# EAGLE design SprinklerPi (EAGLE 6.3)
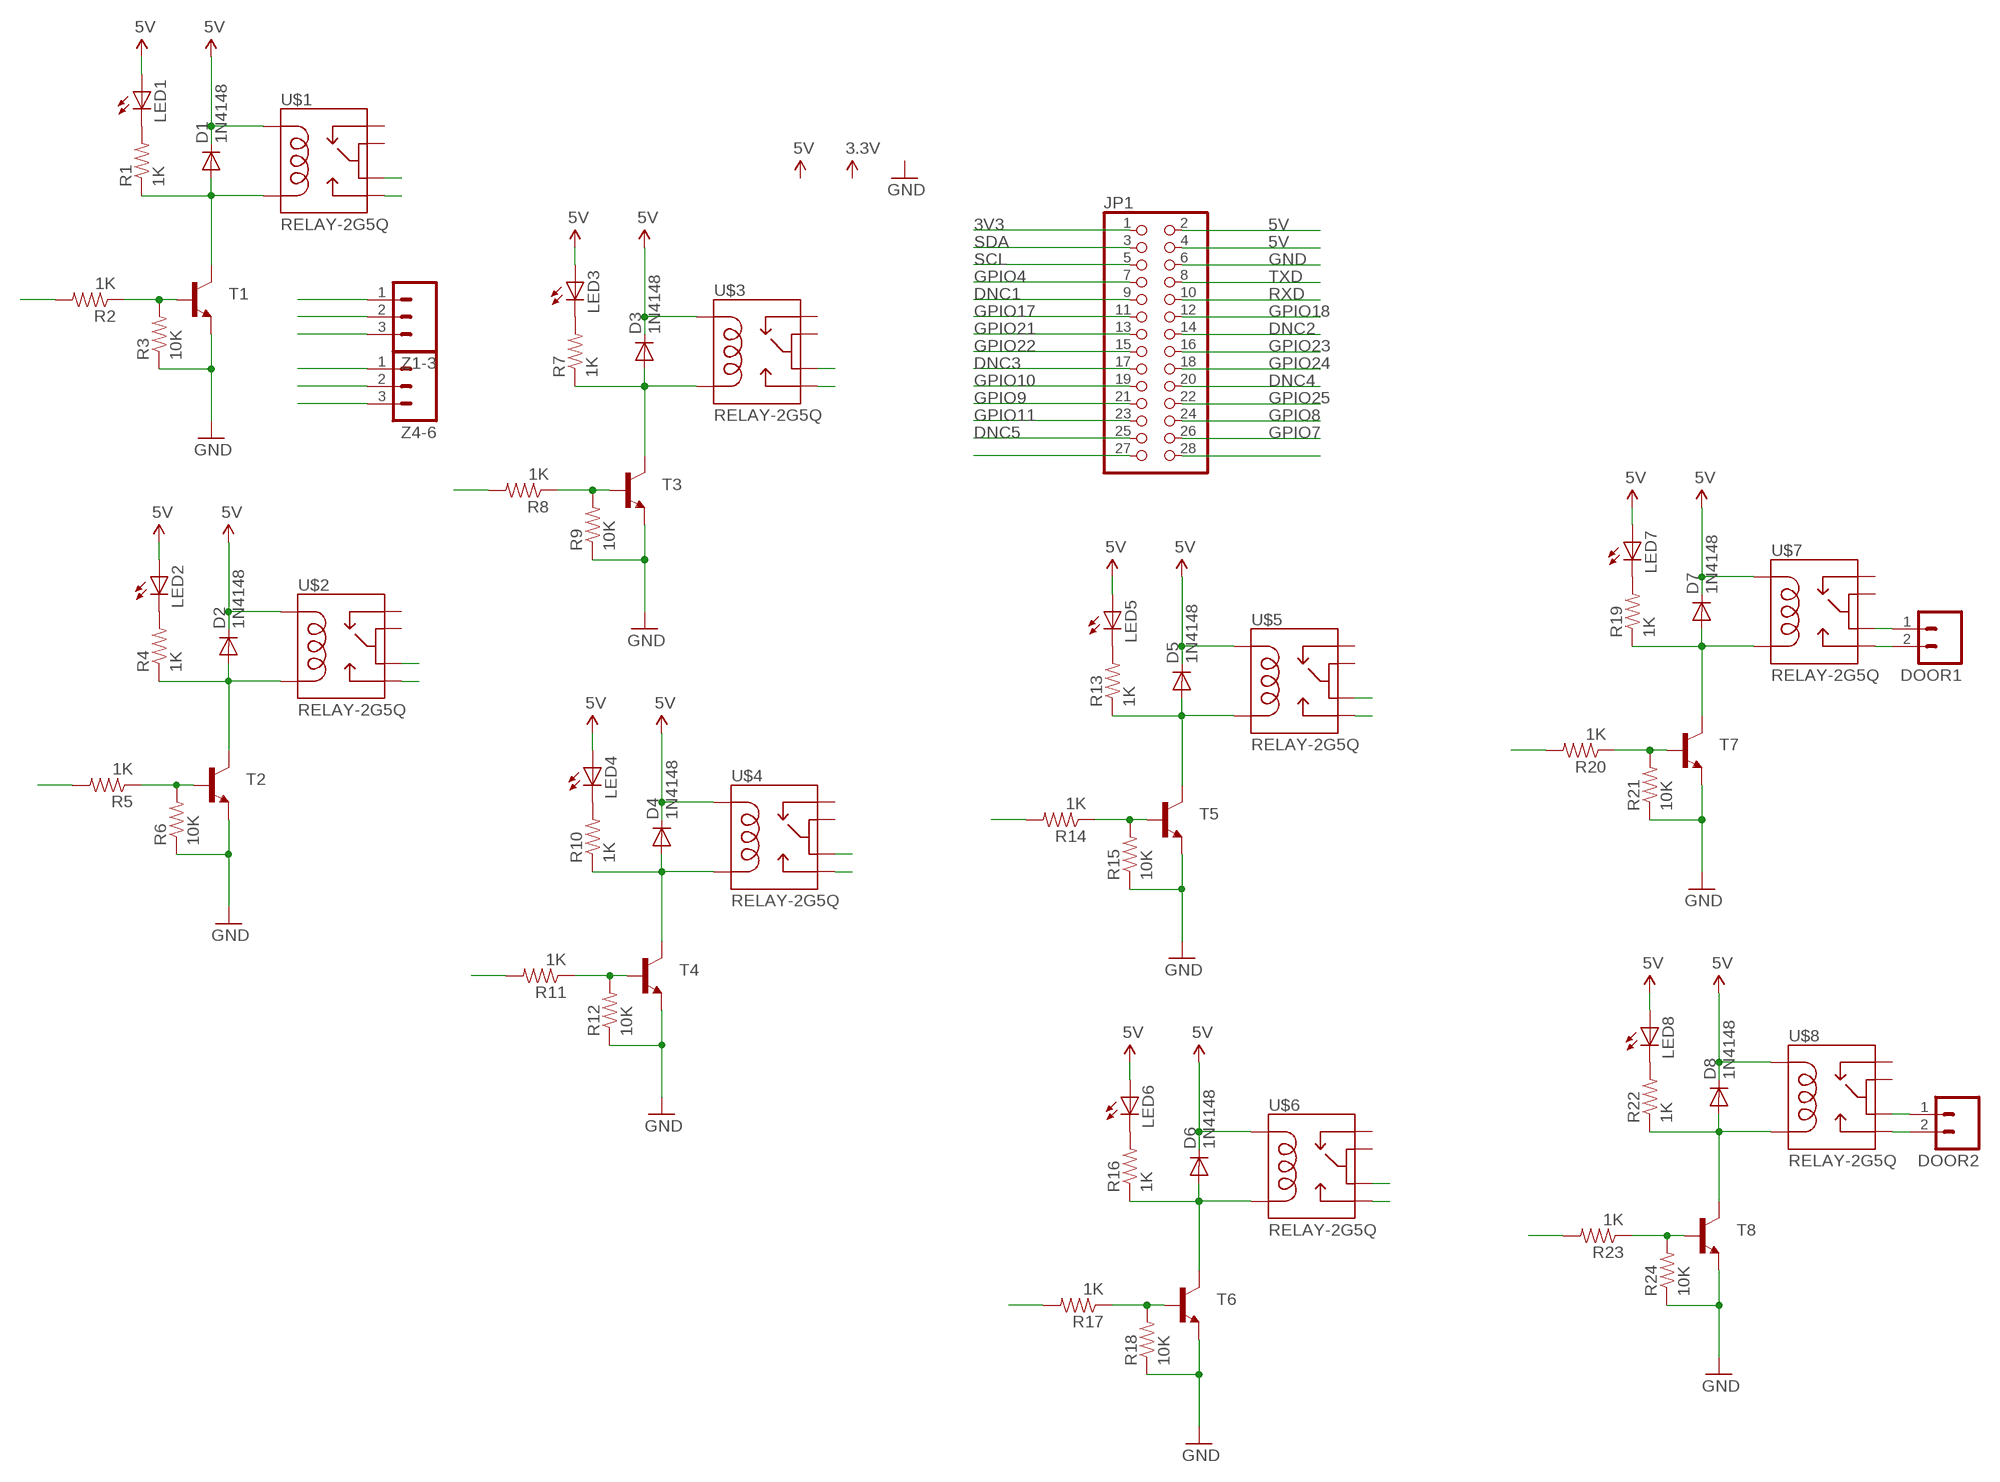
[diagram p0: schematic, sheet 1]

## Parts
D1  1N4148  DIODE1N4148  [DIODE-1N4148]
D2  1N4148  DIODE1N4148  [DIODE-1N4148]
D3  1N4148  DIODE1N4148  [DIODE-1N4148]
D4  1N4148  DIODE1N4148  [DIODE-1N4148]
D5  1N4148  DIODE1N4148  [DIODE-1N4148]
D6  1N4148  DIODE1N4148  [DIODE-1N4148]
D7  1N4148  DIODE1N4148  [DIODE-1N4148]
D8  1N4148  DIODE1N4148  [DIODE-1N4148]
DOOR1  M023.5MM  [SCREWTERMINAL-3.5MM-2]
DOOR2  M023.5MM  [SCREWTERMINAL-3.5MM-2]
JP1  PINHD-2X14-CB  [2X14-CLEANBIG]
LED1  LED-RED1206  [LED-1206]
LED2  LED-RED1206  [LED-1206]
LED3  LED-RED1206  [LED-1206]
LED4  LED-RED1206  [LED-1206]
LED5  LED-RED1206  [LED-1206]
LED6  LED-RED1206  [LED-1206]
LED7  LED-RED1206  [LED-1206]
LED8  LED-RED1206  [LED-1206]
R1  1K  RESISTOR0805-RES  [0805]
R2  1K  RESISTOR0805-RES  [0805]
R3  10K  RESISTOR0805-RES  [0805]
R4  1K  RESISTOR0805-RES  [0805]
R5  1K  RESISTOR0805-RES  [0805]
R6  10K  RESISTOR0805-RES  [0805]
R7  1K  RESISTOR0805-RES  [0805]
R8  1K  RESISTOR0805-RES  [0805]
R9  10K  RESISTOR0805-RES  [0805]
R10  1K  RESISTOR0805-RES  [0805]
R11  1K  RESISTOR0805-RES  [0805]
R12  10K  RESISTOR0805-RES  [0805]
R13  1K  RESISTOR0805-RES  [0805]
R14  1K  RESISTOR0805-RES  [0805]
R15  10K  RESISTOR0805-RES  [0805]
R16  1K  RESISTOR0805-RES  [0805]
R17  1K  RESISTOR0805-RES  [0805]
R18  10K  RESISTOR0805-RES  [0805]
R19  1K  RESISTOR0805-RES  [0805]
R20  1K  RESISTOR0805-RES  [0805]
R21  10K  RESISTOR0805-RES  [0805]
R22  1K  RESISTOR0805-RES  [0805]
R23  1K  RESISTOR0805-RES  [0805]
R24  10K  RESISTOR0805-RES  [0805]
T1  TRANSISTOR_NPNSOT23  [SOT23]
T2  TRANSISTOR_NPNSOT23  [SOT23]
T3  TRANSISTOR_NPNSOT23  [SOT23]
T4  TRANSISTOR_NPNSOT23  [SOT23]
T5  TRANSISTOR_NPNSOT23  [SOT23]
T6  TRANSISTOR_NPNSOT23  [SOT23]
T7  TRANSISTOR_NPNSOT23  [SOT23]
T8  TRANSISTOR_NPNSOT23  [SOT23]
U$1  RELAY-2G5Q  [RELAY-G5V]
U$2  RELAY-2G5Q  [RELAY-G5V]
U$3  RELAY-2G5Q  [RELAY-G5V]
U$4  RELAY-2G5Q  [RELAY-G5V]
U$5  RELAY-2G5Q  [RELAY-G5V]
U$6  RELAY-2G5Q  [RELAY-G5V]
U$7  RELAY-2G5Q  [RELAY-G5V]
U$8  RELAY-2G5Q  [RELAY-G5V]
Z1-3  M03SCREW  [SCREWTERMINAL-3.5MM-3]
Z4-6  M03SCREW  [SCREWTERMINAL-3.5MM-3]

## Nets
3V3: JP1.1
5V: D1.C D2.C D3.C D4.C D5.C D6.C D7.C D8.C JP1.2 JP1.4 LED1.A LED2.A LED3.A LED4.A LED5.A LED6.A LED7.A LED8.A U$1.2 U$2.2 U$3.2 U$4.2 U$5.2 U$6.2 U$7.2 U$8.2
DNC1: JP1.9
DNC2: JP1.14
DNC3: JP1.17
DNC4: JP1.20
DNC5: JP1.25
GND: JP1.6 R3.1 R6.1 R9.1 R12.1 R15.1 R18.1 R21.1 R24.1 T1.2(E) T2.2(E) T3.2(E) T4.2(E) T5.2(E) T6.2(E) T7.2(E) T8.2(E)
GPIO4: JP1.7
GPIO7: JP1.26
GPIO8: JP1.24
GPIO9: JP1.21
GPIO10: JP1.19
GPIO11: JP1.23
GPIO17: JP1.11
GPIO18: JP1.12
GPIO21: JP1.13
GPIO22: JP1.15
GPIO23: JP1.16
GPIO24: JP1.18
GPIO25: JP1.22
N$1: D1.A R1.1 T1.3(C) U$1.9
N$2: LED1.C R1.2
N$3: D7.A R19.1 T7.3(C) U$7.9
N$4: R2.1 R3.2 T1.1(B)
N$5: U$1.6
N$7: R2.2
N$8: D2.A R4.1 T2.3(C) U$2.9
N$9: LED2.C R4.2
N$10: R5.1 R6.2 T2.1(B)
N$11: U$2.6
N$13: R5.2
N$14: JP1.27
N$15: JP1.28
N$16: D3.A R7.1 T3.3(C) U$3.9
N$17: LED3.C R7.2
N$18: R8.1 R9.2 T3.1(B)
N$19: U$3.6
N$21: R8.2
N$22: D4.A R10.1 T4.3(C) U$4.9
N$23: LED4.C R10.2
N$24: R11.1 R12.2 T4.1(B)
N$25: U$4.6
N$27: R11.2
N$28: D5.A R13.1 T5.3(C) U$5.9
N$29: LED5.C R13.2
N$30: R14.1 R15.2 T5.1(B)
N$31: U$5.6
N$33: R14.2
N$34: D6.A R16.1 T6.3(C) U$6.9
N$35: LED6.C R16.2
N$36: R17.1 R18.2 T6.1(B)
N$37: U$6.6
N$39: R17.2
N$40: LED7.C R19.2
N$41: R20.1 R21.2 T7.1(B)
N$42: DOOR1.1 U$7.6
N$44: R20.2
N$45: D8.A R22.1 T8.3(C) U$8.9
N$46: LED8.C R22.2
N$47: R23.1 R24.2 T8.1(B)
N$48: DOOR2.1 U$8.6
N$49: DOOR2.2 U$8.10
N$50: R23.2
RXD: JP1.10
SCL: JP1.5
SDA: JP1.3
TXD: JP1.8
Z1: U$1.10 Z1-3.1
Z2: U$2.10 Z1-3.2
Z3: U$3.10 Z1-3.3
Z4: U$4.10 Z4-6.1
Z5: U$5.10 Z4-6.2
Z6: U$6.10 Z4-6.3
Z7: DOOR1.2 U$7.10
Unconnected: U$1.1 U$1.5 U$2.1 U$2.5 U$3.1 U$3.5 U$4.1 U$4.5 U$5.1 U$5.5 U$6.1 U$6.5 U$7.1 U$7.5 U$8.1 U$8.5

## Library data of the parts
D1-D8 = SparkFun-DiscreteSemi:DIODE: Diode These are standard reverse protection diodes and small signal diodes. SMA package can handle up to about 1A. SOD-323 can handle about 200mA. What the SOD-323 package when ordering, there are some mfgs out there that are 5-pin packages.
DOOR1 DOOR2 = SparkFun-Connectors:M02: Header 2 Standard 2-pin 0.1" header. Use with straight break away headers (SKU : PRT-00116), right angle break away headers (PRT-00553), swiss pins (PRT-00743), machine pins (PRT-00117), and female headers (PRT-00115). Molex polarized connector foot print use with SKU : PRT-08233 with associated crimp pins and housings.
JP1 = adafruit:PINHD-2X14: PIN HEADER
LED1-LED8 = SparkFun-LED:LED-RED: Assorted Red LEDs LilyPad 1206- DIO-09912 1206- DIO-00809 0603- DIO-00819; PROD_ID: DIO-00809; VALUE: RED
R1-R24 = SparkFun-Passives:RESISTOR: Resistor Basic schematic elements and footprints for 0603, 1206, and PTH resistors.
T1-T8 = SparkFun-DiscreteSemi:TRANSISTOR_NPN: Generic NPN BJT. MMBT2222 is the common NPN we use. Double check against datasheet- not all devices are the same!
U$1-U$8 = SparkFun-Electromechanical:RELAY-2: SPDT relay (COM-00100)
Z1-3 Z4-6 = SparkFun-Connectors:M03: Header 3 Standard 3-pin 0.1" header. Use with straight break away headers (SKU : PRT-00116), right angle break away headers (PRT-00553), swiss pins (PRT-00743), machine pins (PRT-00117), and female headers (PRT-00115). Molex polarized connector foot print use with SKU : PRT-08232 with associated crimp pins and housings.

## Board
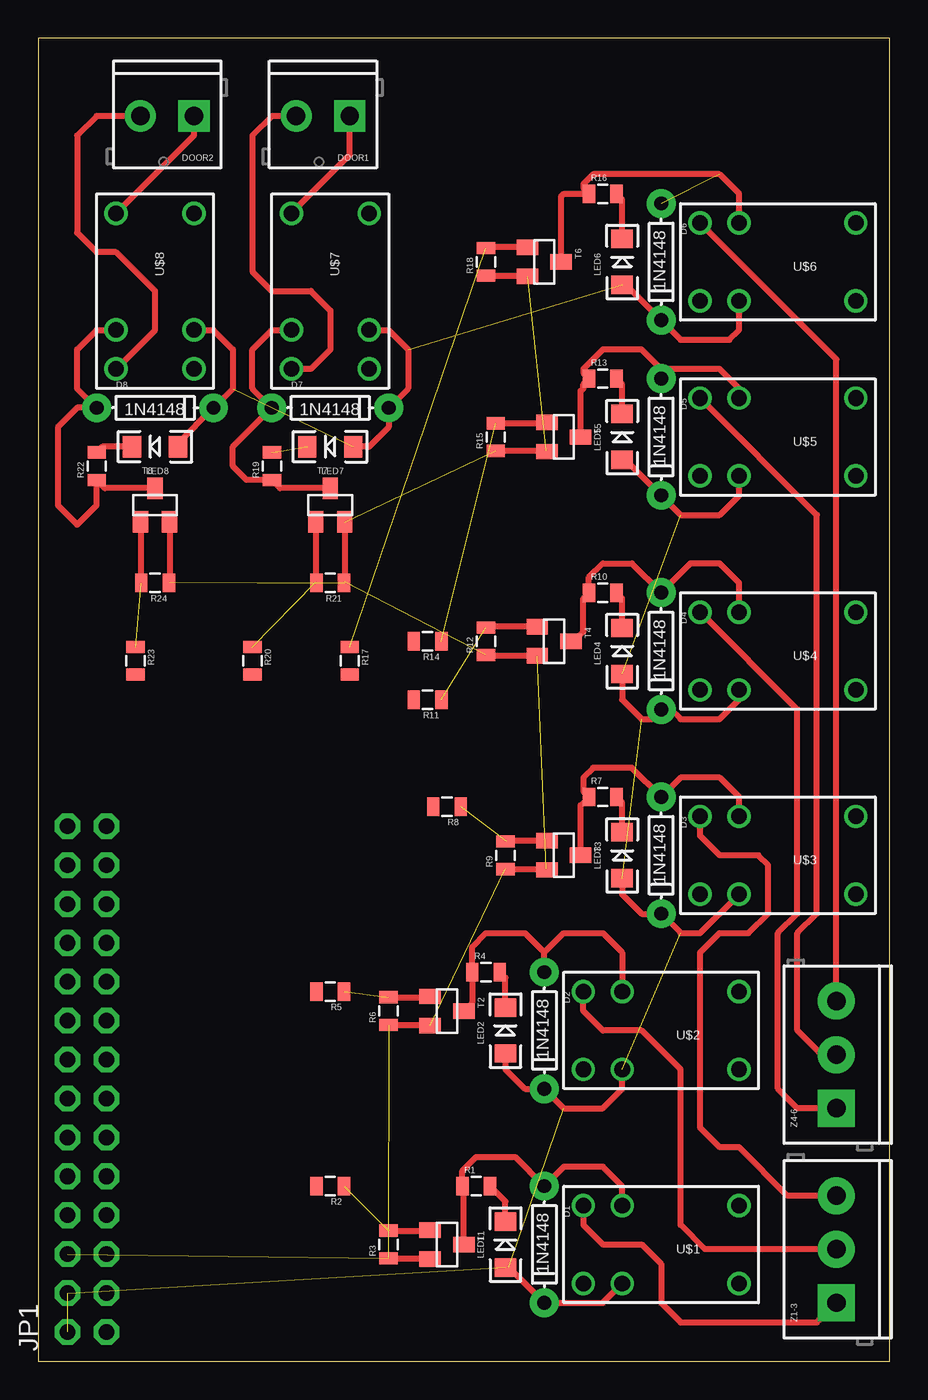
[diagram p1: board, top side]
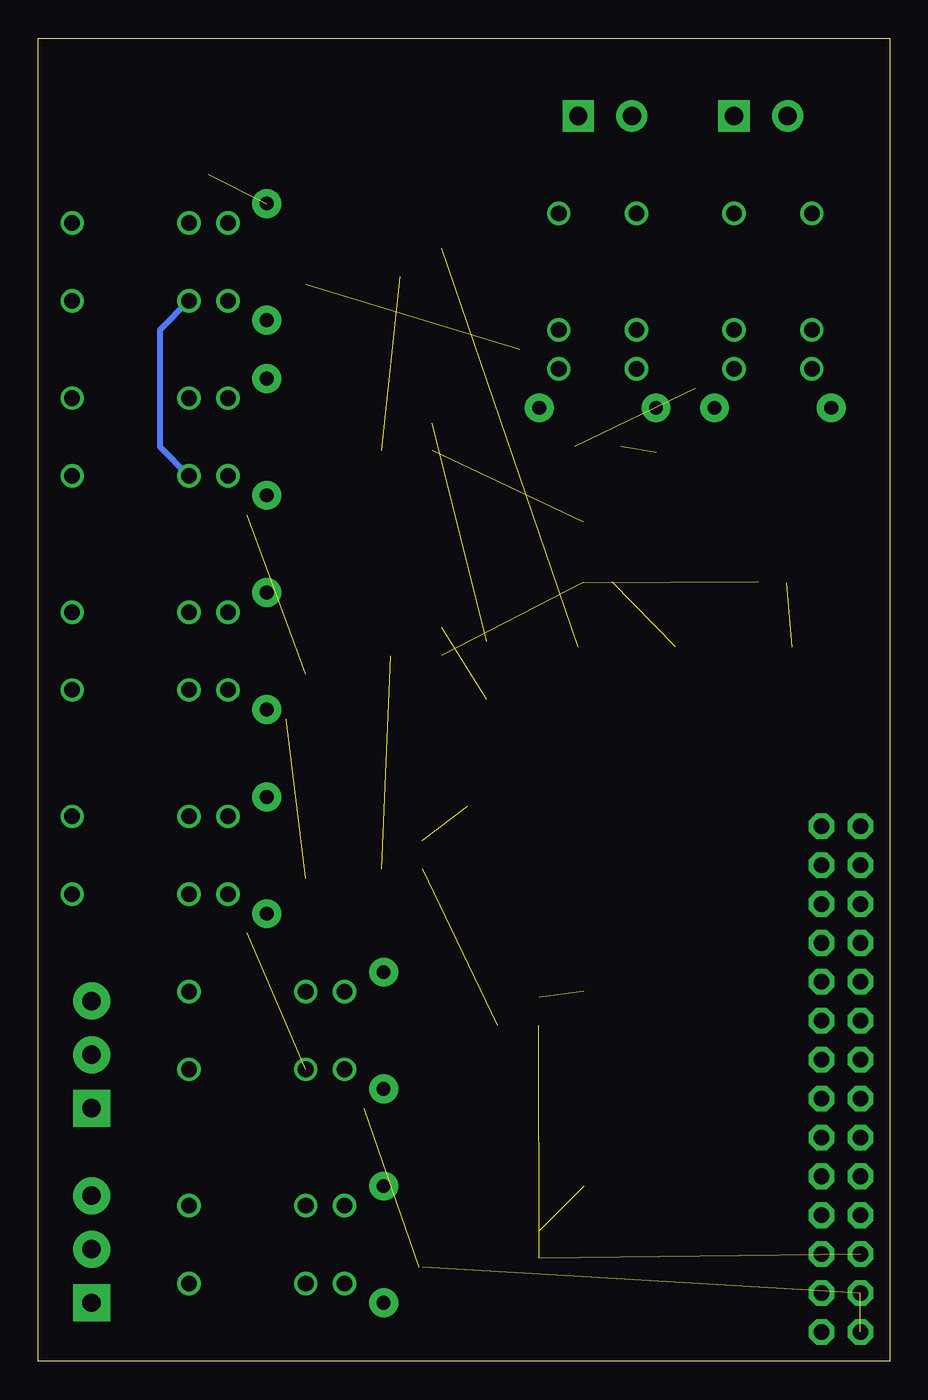
[diagram p2: board, bottom side, seen from below]

Size 55.55 x 86.35 mm. Coordinates in mm from the lower left corner, seen from the top.
Outline: 0,0 55.55,0 55.55,86.35 0,86.35 0,0
Copper layers (1*16): Top 0.035mm / dielectric 1.5mm / Bottom 0.035mm
Design rules "default": minimum track width 10mil, minimum drill 24mil, track to track 8mil, track to pad 8mil, pad to pad 8mil, via to via 8mil, smd to smd 8mil, copper to edge 40mil, drill to drill 8mil, minimum pad ring 10mil, minimum via ring 8mil, stop-mask expansion 4mil, vias tented up to drill 0mil, thermal gap 10mil

### Footprints (pad centres in the part's own frame; a part is rotated, then mirrored left to right if it is on the bottom)
DIODE-1N4148 = drill 0.9 pad 1.88: A -3.81,0; C 3.81,0
SCREWTERMINAL-3.5MM-2 = drill 1.2 pad 2.032 square: 1 0,0 | drill 1.2 pad 2.032: 2 3.5,0
2X14-CLEANBIG = drill 1.016 pad 1.676 octagon: 1 -16.51,-1.27; 2 -16.51,1.27; 3 -13.97,-1.27; 4 -13.97,1.27; 5 -11.43,-1.27; 6 -11.43,1.27; 7 -8.89,-1.27; 8 -8.89,1.27; 9 -6.35,-1.27; 10 -6.35,1.27; 11 -3.81,-1.27; 12 -3.81,1.27; 13 -1.27,-1.27; 14 -1.27,1.27; 15 1.27,-1.27; 16 1.27,1.27; 17 3.81,-1.27; 18 3.81,1.27; 19 6.35,-1.27; 20 6.35,1.27; 21 8.89,-1.27; 22 8.89,1.27; 23 11.43,-1.27; 24 11.43,1.27; 25 13.97,-1.27; 26 13.97,1.27; 27 16.51,-1.27; 28 16.51,1.27
LED-1206 = smd 1.2 x 1.4: A -1.5,0; C 1.5,0
0805 = smd 0.8 x 1.2: 1 -0.9,0; 2 0.9,0
SOT23 = smd 1 x 1.4: 1 -0.95,-1.1; 2 0.95,-1.1; 3 0,1.1
RELAY-G5V = drill 1.016: 1 5.08,2.54; 2 2.54,2.54; 5 -5.08,2.54; 6 -5.08,-2.54; 9 2.54,-2.54; 10 5.08,-2.54
SCREWTERMINAL-3.5MM-3 = drill 1.2 pad 2.413 square: 1 0,0 | drill 1.2 pad 2.413: 2 3.5,0; 3 7,0

### Placement (x,y rotation side)
D1  33.02,7.62 270 top
D2  33.02,21.59 270 top
D3  40.64,33.02 270 top
D4  40.64,46.35 270 top
D5  40.64,60.33 270 top
D6  40.64,71.75 270 top
D7  19.05,62.23 0 top
D8  7.62,62.23 0 top
DOOR1  20.32,81.28 180 top
DOOR2  10.16,81.28 180 top
JP1  3.17,18.41 90 top
LED1  30.48,7.62 90 top
LED2  30.48,21.59 90 top
LED3  38.1,33.02 90 top
LED4  38.1,46.35 90 top
LED5  38.1,60.33 90 top
LED6  38.1,71.75 90 top
LED7  19.05,59.69 180 top
LED8  7.62,59.69 180 top
R1  28.57,11.43 0 top
R2  19.05,11.43 180 top
R3  22.86,7.62 90 top
R4  29.21,25.4 0 top
R5  19.05,24.13 180 top
R6  22.86,22.86 90 top
R7  36.83,36.83 0 top
R8  26.67,36.2 180 top
R9  30.48,33.02 90 top
R10  36.83,50.16 0 top
R11  25.4,43.18 180 top
R12  29.21,46.99 90 top
R13  36.83,64.14 0 top
R14  25.4,46.99 180 top
R15  29.84,60.33 90 top
R16  36.83,76.2 0 top
R17  20.32,45.72 270 top
R18  29.21,71.75 90 top
R19  15.24,58.42 90 top
R20  13.97,45.72 270 top
R21  19.05,50.8 180 top
R22  3.81,58.42 90 top
R23  6.35,45.72 270 top
R24  7.62,50.8 180 top
T1  26.67,7.62 270 top
T2  26.67,22.86 270 top
T3  34.29,33.02 270 top
T4  33.66,46.99 270 top
T5  34.29,60.33 270 top
T6  33.02,71.75 270 top
T7  19.05,55.88 0 top
T8  7.62,55.88 0 top
U$1  40.64,7.62 180 top
U$2  40.64,21.59 180 top
U$3  48.26,33.02 180 top
U$4  48.26,46.35 180 top
U$5  48.26,60.33 180 top
U$6  48.26,71.75 180 top
U$7  19.05,69.85 270 top
U$8  7.62,69.85 270 top
Z1-3  52.07,3.81 90 top
Z4-6  52.07,16.51 90 top

### Tracks (layer width: path | path; a pad name or v marks a point on that pad's centre or on a via)
5V  (via drill 0.6)  (8 unrouted)
  Top 0.406: U$8.2 11.43,67.31 12.7,66.04 12.7,63.5 D8.C 9.12,59.92 LED8.A | U$7.2 22.86,67.31 24.13,66.04 24.13,63.5 D7.C 22.86,60.96 21.59,59.69 LED7.A | LED1.A 30.71,6.12 D1.C 36.83,3.81 U$1.2 | LED2.A 30.48,19.05 31.75,17.78 D2.C 34.29,16.51 36.83,16.51 38.1,17.78 U$2.2 | LED3.A 38.1,30.48 39.37,29.21 D3.C 41.91,27.94 43.18,27.94 U$3.2 | LED4.A 38.1,43.18 39.37,41.91 40.01,41.91 D4.C 41.27,42.55 41.91,41.91 44.45,41.91 45.72,43.18 U$4.2 | LED5.A 38.33,58.83 D5.C 41.91,55.24 44.45,55.24 45.72,56.52 U$5.2 | LED6.A 38.33,70.25 D6.C 41.91,66.67 45.09,66.67 45.72,67.31 45.72,68.58 v45.72,69.22
  Bottom 0.406: v45.72,69.22 47.62,67.31 47.62,59.69 U$5.2
GND  (8 unrouted)
  Top 0.406: T1.2 22.91,6.67 R3.1 | T2.2 22.91,21.91 R6.1 | R9.1 33.14,32.12 T3.2 | T4.2 29.26,46.04 R12.1 | R15.1 33.14,59.42 T5.2 | R18.1 31.48,70.86 31.75,71.12 31.75,70.97 T6.2 | T7.2 20,50.85 R21.1 | T8.2 8.57,50.85 R24.1
N$1
  Top 0.406: U$1.9 38.1,11.43 36.83,12.7 34.29,12.7 D1.A 31.11,13.34 28.57,13.34 27.68,12.44 R1.1 27.77,11.34 T1.3
N$2
  Top 0.406: LED1.C 30.48,10.43 R1.2
N$3
  Top 0.406: U$7.9 15.24,67.31 13.97,66.04 13.97,63.5 D7.A 12.7,59.69 12.7,58.42 13.6,57.52 R19.1 15.78,56.98 T7.3
N$4  (1 unrouted)
  Top 0.406: R3.2 25.52,8.52 T1.1
N$8
  Top 0.406: T2.3 28.31,23.4 R4.1 28.31,27.04 29.21,27.94 31.75,27.94 33.02,26.67 | D2.A 33.02,26.67 | 33.02,26.67 34.29,27.94 36.83,27.94 38.1,26.67 U$2.9
N$9
  Top 0.406: LED2.C 30.48,25.03 R4.2
N$10  (1 unrouted)
  Top 0.406: R6.2 25.52,23.76 T2.1
N$16
  Top 0.406: U$3.9 45.72,36.83 44.45,38.1 41.91,38.1 D3.A 38.73,38.73 36.2,38.73 35.56,38.1 35.56,37.2 R7.1 35.39,36.29 T3.3
N$17
  Top 0.406: LED3.C 38.1,36.46 R7.2
N$18  (1 unrouted)
  Top 0.406: T3.1 30.53,33.97 R9.2
N$22
  Top 0.406: U$4.9 45.72,50.8 44.45,52.07 42.55,52.07 D4.A 38.73,52.07 36.83,52.07 35.93,51.17 R10.1 35.56,49.8 35.56,47.62 34.92,46.99 T4.3
N$23
  Top 0.406: LED4.C 38.1,49.8 R10.2
N$24  (1 unrouted)
  Top 0.406: T4.1 29.26,47.94 R12.2
N$28
  Top 0.406: T5.3 35.39,63.33 35.56,63.5 35.56,63.77 R13.1 35.56,64.5 35.56,64.77 36.83,66.04 39.37,66.04 40.64,64.77 | D5.A 40.64,64.77 | U$5.9 45.72,63.5 44.45,64.77 40.64,64.77
N$29
  Top 0.406: LED5.C 38.1,63.77 R13.2
N$30  (1 unrouted)
  Top 0.406: R15.2 33.14,61.23 T5.1
N$34  (1 unrouted)
  Top 0.406: U$6.9 45.72,76.2 44.45,77.47 36.2,77.47 35.56,76.83 35.56,76.57 R16.1 34.29,76.2 34.12,76.03 T6.3
N$35
  Top 0.406: LED6.C 38.1,75.83 R16.2
N$36  (1 unrouted)
  Top 0.406: T6.1 29.26,72.7 R18.2
N$40  (1 unrouted)
N$41  (1 unrouted)
  Top 0.406: T7.1 18.1,50.85 R21.2
N$42
  Top 0.406: U$7.6 20.32,78.74 DOOR1.1
N$45
  Top 0.406: U$8.9 3.81,67.31 2.54,66.04 2.54,63.5 D8.A 2.54,62.23 1.27,60.96 1.27,55.88 2.54,54.61 3.81,55.88 R22.1 4.35,56.98 T8.3
N$46
  Top 0.406: LED8.C 4.18,59.69 R22.2
N$47  (1 unrouted)
  Top 0.406: T8.1 6.67,50.85 R24.2
N$48
  Top 0.406: U$8.6 10.16,80.01 DOOR2.1
N$49
  Top 0.406: U$8.10 7.62,67.31 7.62,69.85 5.08,72.39 3.81,72.39 2.54,73.66 2.54,80.01 3.81,81.28 DOOR2.2
Z1
  Top 0.406: U$1.10 35.56,8.89 36.83,7.62 39.37,7.62 40.64,6.35 40.64,3.81 41.91,2.54 50.8,2.54 Z1-3.1
Z2
  Top 0.406: Z1-3.2 43.49,7.31 41.91,8.89 41.91,19.05 39.37,21.59 36.83,21.59 35.56,22.86 U$2.10
Z3
  Top 0.406: Z1-3.3 48.88,10.81 45.72,13.97 44.45,13.97 43.18,15.24 43.18,26.67 44.45,27.94 46.35,27.94 47.62,29.21 47.62,32.38 46.99,33.02 44.45,33.02 43.18,34.29 U$3.10
Z4
  Top 0.406: Z4-6.1 49.53,16.51 48.26,17.78 48.26,27.94 49.53,29.21 49.53,42.55 U$4.10
Z5
  Top 0.406: Z4-6.2 51.11,20.01 49.53,21.59 49.53,27.94 50.8,29.21 50.8,55.24 U$5.10
Z6
  Top 0.406: Z4-6.3 52.07,65.41 U$6.10
Z7
  Top 0.406: DOOR1.2 15.24,81.28 13.97,80.01 13.97,71.12 15.24,69.85 17.78,69.85 19.05,68.58 19.05,66.04 17.78,64.77 U$7.10